# Altium project MaplePadFightingBoard.PrjPcb
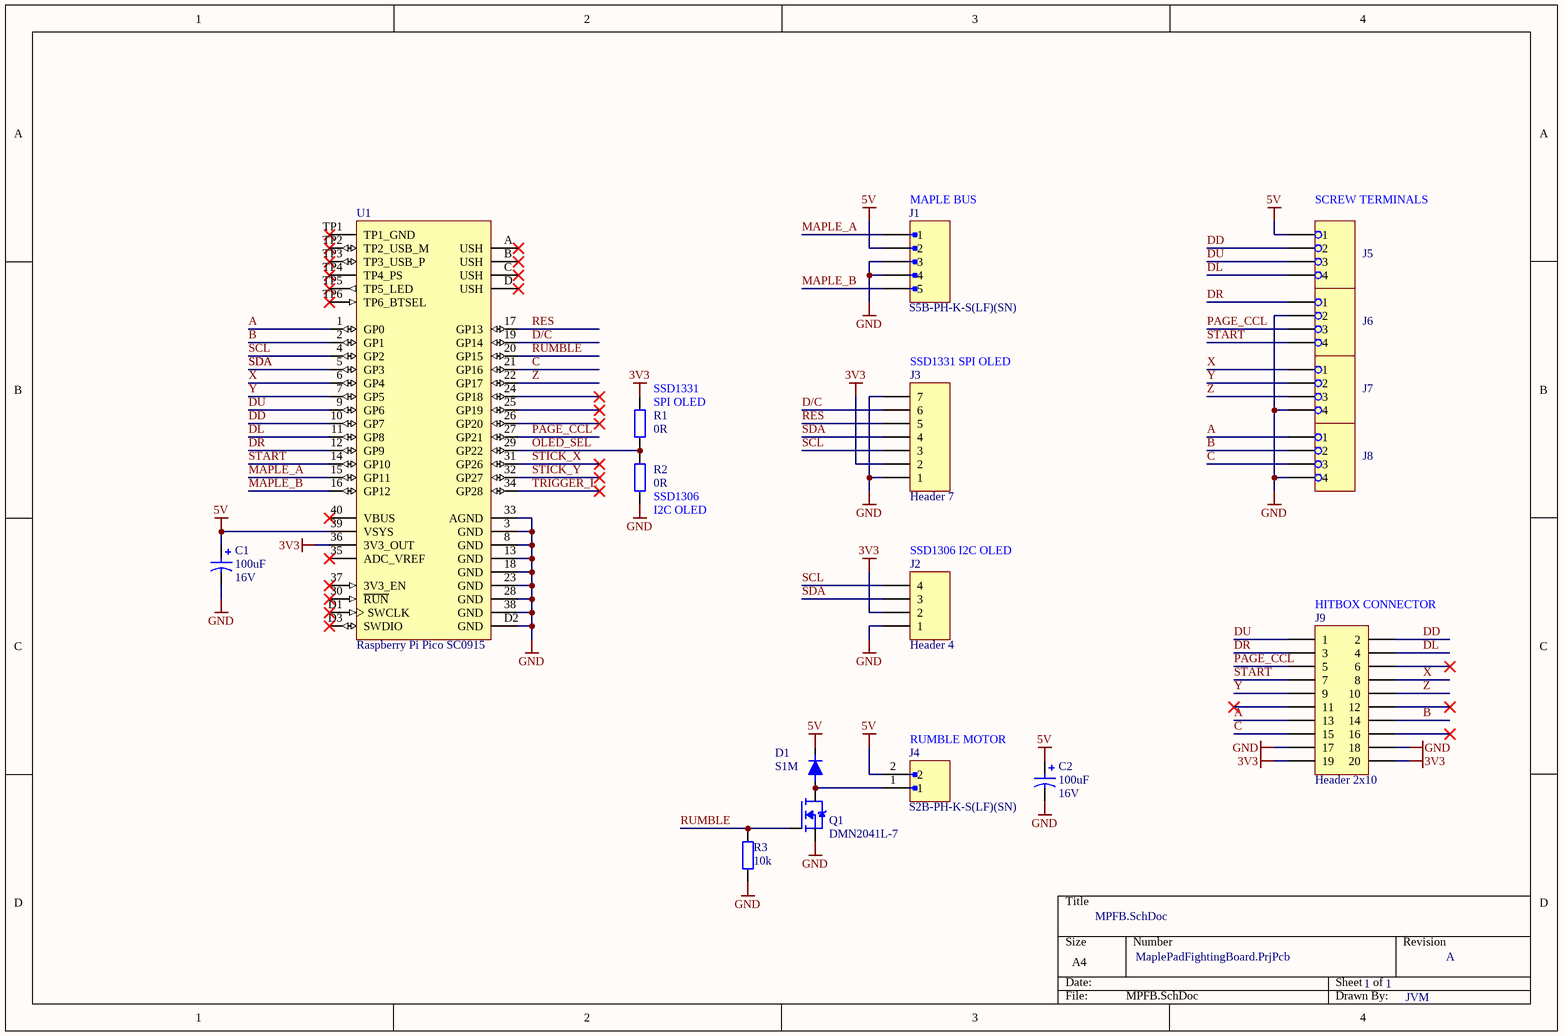
[diagram p0: MPFB.SchDoc]
1 sheet, 17 parts. Net scope: global (net labels, ports and power ports of the same name join across sheets).
Board file: MPFB.PcbDoc

## Sheet MPFB.SchDoc
size A4; SheetNumber: 1; SheetTotal: 1

### Parts
C1  value 100uF  Voltage: 16V  [Cap2.54P5.0D]  (hidden comment: Cap2.54P5.0D)
C2  value 100uF  Voltage: 16V  [Cap2.54P5.0D]  (hidden comment: Cap2.54P5.0D)
D1  S1M  [DIOM5227X270N]
J1  S5B-PH-K-S(LF)(SN)  [JST_S5B-PH-K-S(LF)(SN)]
J2  Header 4  [HDR1X4]
J3  Header 7  [HDR1X7]
J4  S2B-PH-K-S(LF)(SN)  [JST_S2B-PH-K-S(LF)(SN)]
J5  1751264  [PHOENIX_1751264]  (value not drawn)
J6  1751264  [PHOENIX_1751264]  (value not drawn)
J7  1751264  [PHOENIX_1751264]  (value not drawn)
J8  1751264  [PHOENIX_1751264]  (value not drawn)
J9  Header 2x10  [HDR2X10]
Q1  DMN2041L-7  [SOT91P240X110-3N]
R1  value 0R  [RESC1608N]  (hidden comment: Res0603)
R2  value 0R  [RESC1608N]  (hidden comment: Res0603)
R3  value 10k  [RESC2012N]  (hidden comment: Res0805)
U1  Raspberry Pi Pico SC0915  [MODULE_SC0915]

### Nets
3V3: J2.2 J3.2 J9.19 J9.20 R1.2 U1.36(3V3_OUT)
5V: C1.1 C2.1 D1.C(K) J1.2 J4.2 J5.1 U1.39(VSYS)
GND: C1.2 C2.2 J1.3 J1.4 J2.1 J3.1 J3.7 J6.2 J7.4 J8.4 J9.17 J9.18 Q1.2(S) R2.1 R3.1 U1.3(GND) U1.8(GND) U1.13(GND) U1.18(GND) U1.23(GND) U1.28(GND) U1.33(AGND) U1.38(GND) U1.D2(GND)
A: J8.1 J9.13 U1.1(GP0)
B: J8.2 J9.14 U1.2(GP1)
C: J8.3 J9.15 U1.21(GP16)
D/C: J3.6 U1.19(GP14)
DD: J5.2 J9.2 U1.10(GP7)
DL: J5.4 J9.4 U1.11(GP8)
DR: J6.1 J9.3 U1.12(GP9)
DU: J5.3 J9.1 U1.9(GP6)
MAPLE_A: J1.1 U1.15(GP11)
MAPLE_B: J1.5 U1.16(GP12)
OLED_SEL: R1.1 R2.2 U1.29(GP22)
PAGE_CCL: J6.3 J9.5 U1.27(GP21)
RES: J3.5 U1.17(GP13)
RUMBLE: Q1.1(G) R3.2 U1.20(GP15)
SCL: J2.4 J3.3 U1.4(GP2)
SDA: J2.3 J3.4 U1.5(GP3)
START: J6.4 J9.7 U1.14(GP10)
STICK_X: U1.31(GP26)
STICK_Y: U1.32(GP27)
TRIGGER_L: U1.34(GP28)
X: J7.1 J9.8 U1.6(GP4)
Y: J7.2 J9.9 U1.7(GP5)
Z: J7.3 J9.10 U1.22(GP17)
NetD1_A: D1.A J4.1 Q1.3(D)

Not connected (* = marked no-connect by the designer): J9 6* 11* 12* 16*; U1 24(GP18)* 25(GP19)* 26(GP20)* 30(~{RUN})* 35(ADC_VREF)* 37(3V3_EN)* 40(VBUS)* A(USH)* B(USH)* C(USH)* D(USH)* D1(SWCLK)* D3(SWDIO)* TP1(TP1_GND)* TP2(TP2_USB_M)* TP3(TP3_USB_P)* TP4(TP4_PS)* TP5(TP5_LED)* TP6(TP6_BTSEL)*

### Notes on the sheet
- (near J1) MAPLE BUS
- (near J5) SCREW TERMINALS
- (near J3) SSD1331 SPI OLED
- (near R1) SSD1331
- (near R1) SPI OLED
- (near R2) SSD1306
- (near R2) I2C OLED
- (near J2) SSD1306 I2C OLED
- (near J9) HITBOX CONNECTOR
- (near J4) RUMBLE MOTOR
- A
- JVM

### Library data of the parts
C1 C2 = Cap2.54P5.0D: Polarized Capacitor, 2.54mm Pitch, 5mm Width
D1 = S1M: Diode Standard 1000 V 1A Surface Mount DO-214AC (SMA); MF: Diotec Semiconductor; Value: *; MP: S1M; Price: None; Package: DO-214AC-2 Diotec; Availability: In Stock; SnapEDA_Link: https://www.snapeda.com/parts/S1M/Diotec/view-part/?ref=snap; Purchase-URL: https://pricing.snapeda.com/search/part/S1M/?ref=eda; Check_prices: https://www.snapeda.com/parts/S1M/Diotec/view-part/?ref=eda
J1 = S5B-PH-K-S(LF)(SN): JST PH Header Through Hole, Right Angle 5 position(2.00mm); MF: JST Sales America Inc.; Package: NON STANDARD-5 J.S.T.; Price: None; Check_prices: https://www.snapeda.com/parts/S5B-PH-K-S(LF)(SN)/JST+Sales+America+Inc./view-part/?ref=eda; Value: *; SnapEDA_Link: https://www.snapeda.com/parts/S5B-PH-K-S(LF)(SN)/JST+Sales+America+Inc./view-part/?ref=snap; MP: S5B-PH-K-S(LF)(SN); Availability: In Stock; Purchase-URL: https://pricing.snapeda.com/search/part/S5B-PH-K-S(LF)(SN)/?ref=eda
J2 = Header 4: 2,54mm pitch header, 4 positions; Pitch: 2.54mm
J3 = Header 7: 2,54mm pitch header, 7 positions; Pitch: 2.54mm
J4 = S2B-PH-K-S(LF)(SN): JST PH Header Through Hole, Right Angle 2 position(2.00mm); MF: JST Sales America Inc.; Price: None; Availability: In Stock; Package: None; MP: S2B-PH-K-S(LF)(SN); Value: *; SnapEDA_Link: https://www.snapeda.com/parts/S2B-PH-K-S(LF)(SN)/JST+Sales+America+Inc./view-part/?ref=snap; Purchase-URL: https://pricing.snapeda.com/search/part/S2B-PH-K-S(LF)(SN)/?ref=eda; Check_prices: https://www.snapeda.com/parts/S2B-PH-K-S(LF)(SN)/JST+Sales+America+Inc./view-part/?ref=eda
J5-J8 = 1751264: PCB Terminal Screw 3.5mm 16AWG 200V 13.5A 4 Position COMBICON MKDS Series | Phoenix Contact 1751264; SnapEDA_Link: https://www.snapeda.com/parts/1751264/Phoenix+Contact/view-part/?ref=snap; Package: None; Value: *; MF: Phoenix Contact; MP: 1751264; Check_prices: https://www.snapeda.com/parts/1751264/Phoenix+Contact/view-part/?ref=eda
J9 = Header 2x10: 2,54mm pitch header, 2x10 positions; Pitch: 2.54mm
Q1 = DMN2041L-7: MOSFET N-Channel 20V 6.4A SOT23 | Diodes Inc DMN2041L-7; MF: Diodes Inc.; SnapEDA_Link: https://www.snapeda.com/parts/DMN2041L-7/Diodes+Inc./view-part/?ref=snap; Package: SOT-23 Diodes Inc.; Value: *; MP: DMN2041L-7; Check_prices: https://www.snapeda.com/parts/DMN2041L-7/Diodes+Inc./view-part/?ref=eda
R1 R2 = Res0603: Resistor (SMD), 0603; PackageReference: RESC1608N
R3 = Res0805: Resistor (SMD), 0805; PackageReference: RESC2012N
U1 = SC0915: Raspberry Pi Pico; SnapEDA_Link: https://www.snapeda.com/parts/SC0915/Raspberry+Pi/view-part/?ref=snap; Availability: In Stock; Package: None; Price: None; MP: SC0915; Check_prices: https://www.snapeda.com/parts/SC0915/Raspberry+Pi/view-part/?ref=eda; MF: Raspberry Pi; Value: *; Purchase-URL: https://pricing.snapeda.com/search/part/SC0915/?ref=eda